# EAGLE design NFC_reva (EAGLE 7.2.0)
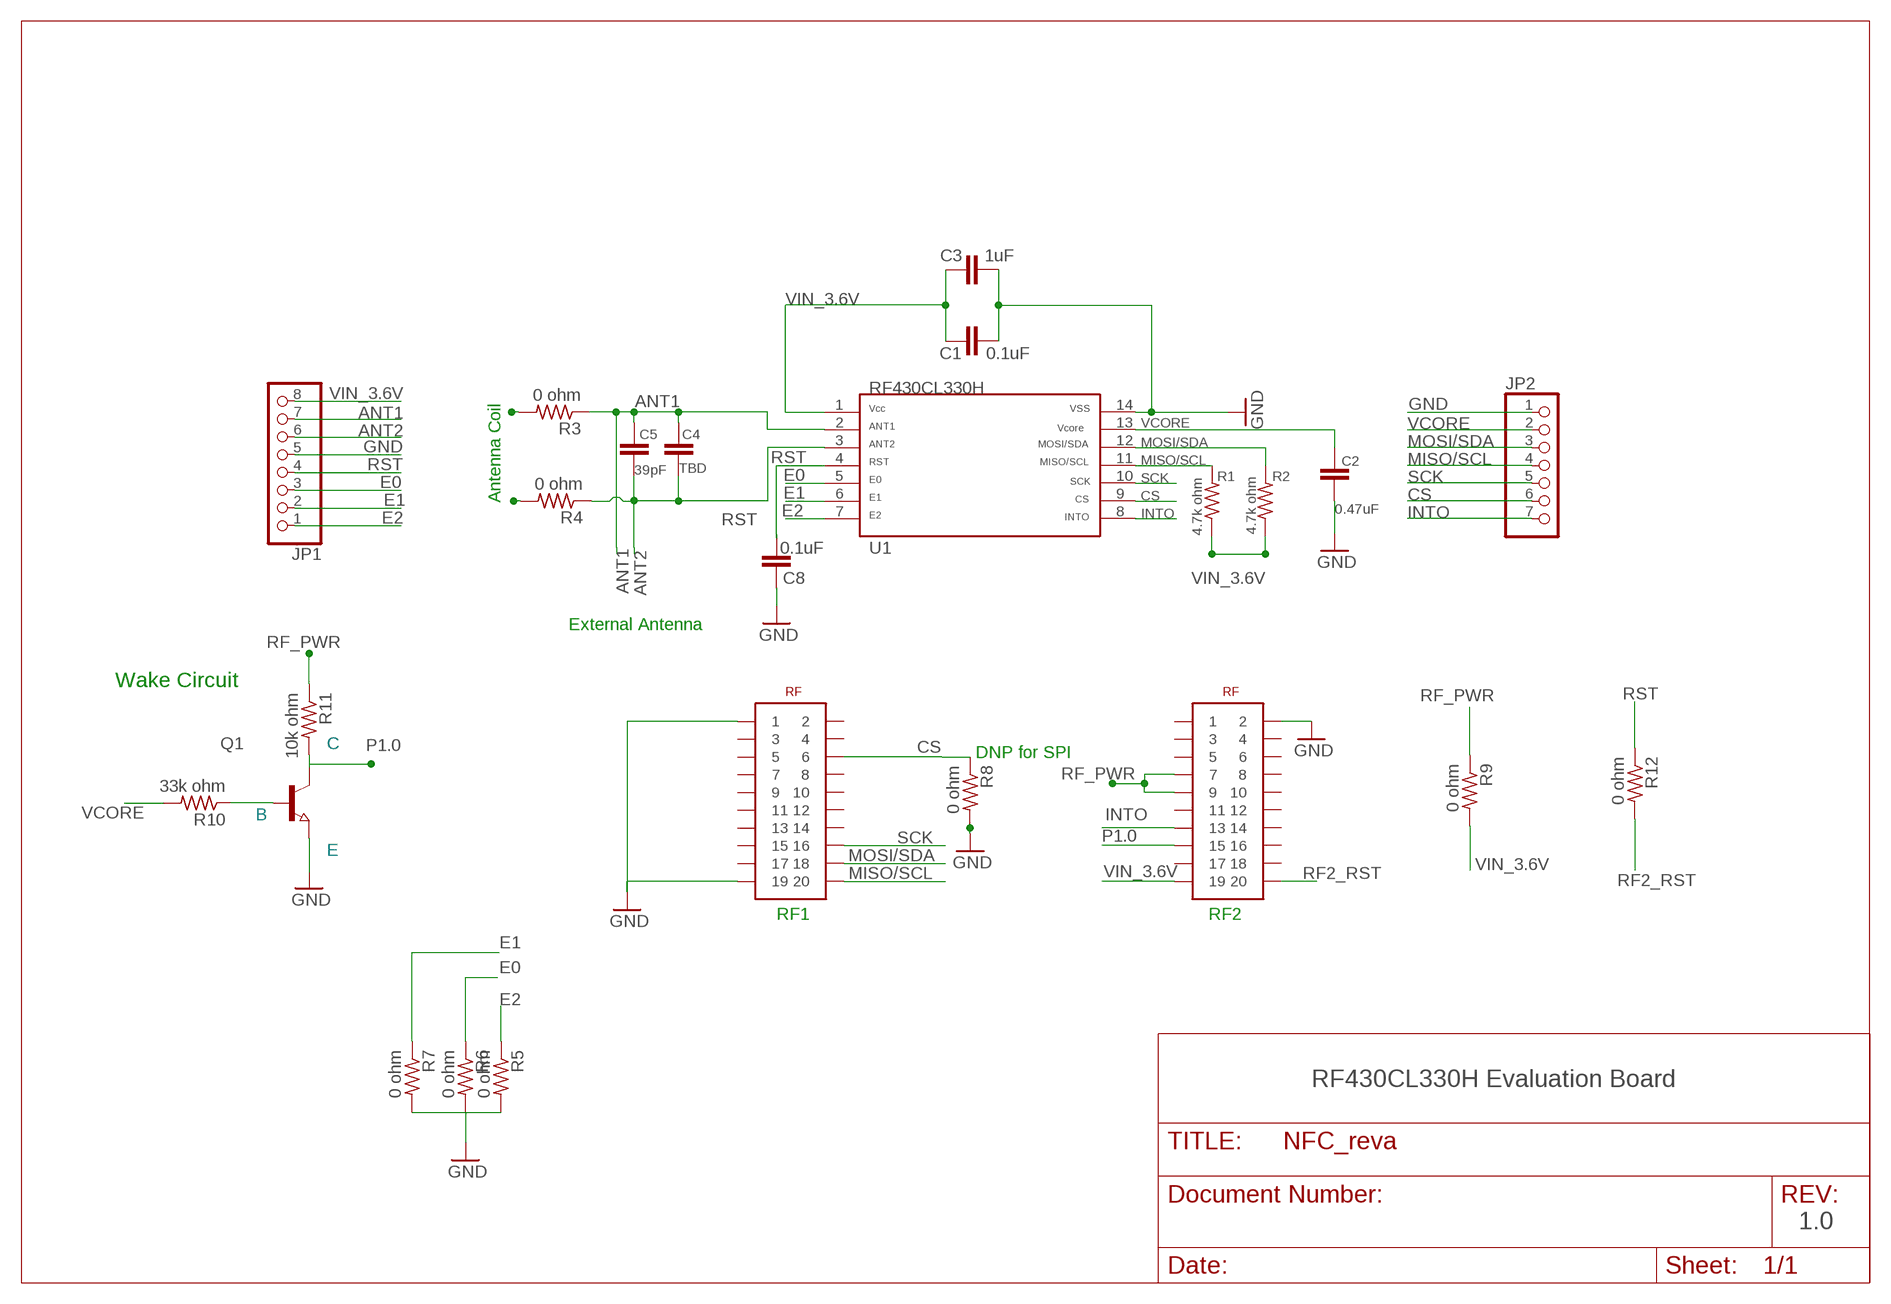
[diagram p0: schematic, sheet 1]

## Parts
C1  0.1uF  C-EUC0603  [C0603]
C2  0.47uF  C-EUC0603  [C0603]
C3  1uF  C-EUC0603  [C0603]
C4  TBD  C-EUC0603  [C0603]
C5  39pF  C-EUC0603  [C0603]
C8  0.1uF  C-EUC0603  [C0603]
JP1  PINHD-1X8  [1X08]
JP2  PINHD-1X7  [1X07]
Q1  NPN-TRANSISTOR_SOT23  [SOT23]
R1  4.7k ohm  R-US_R0402  [R0402]
R2  4.7k ohm  R-US_R0402  [R0402]
R3  0 ohm  R-US_R0402  [R0402]
R4  0 ohm  R-US_R0402  [R0402]
R5  0 ohm  R-US_R0402  [R0402]
R6  0 ohm  R-US_R0402  [R0402]
R7  0 ohm  R-US_R0402  [R0402]
R8  0 ohm  R-US_R0402  [R0402]
R9  0 ohm  R-US_R0402  [R0402]
R10  33k ohm  R-US_R0402  [R0402]
R11  10k ohm  R-US_R0402  [R0402]
R12  0 ohm  R-US_R0402  [R0402]
RF_HEADER  EM_HEADER  [TFM-110-02-SM-D-A-K]
U1  RF430CL330H  [PW14]

## Nets
ANT1: C4.1 C5.1 JP1.7 R3.1 U1.2
ANT2: C4.2 C5.2 JP1.6 R4.1 U1.3
CS: JP2.6 R8.1 RF_HEADER.6 U1.9
E0: JP1.3 R6.1 U1.5
E1: JP1.2 R7.1 U1.6
E2: JP1.1 R5.1 U1.7
GND [Ground]: C1.2 C2.2 C3.2 C8.1 JP1.5 JP2.1 Q1.2(E) R5.2 R6.2 R7.2 R8.2 RF_HEADER.1 RF_HEADER.19 RF_HEADER.22 U1.14
INTO: JP2.7 RF_HEADER.33 U1.8
MISO/SCL: JP2.4 R1.2 RF_HEADER.20 U1.11
MOSI/SDA: JP2.3 R2.2 RF_HEADER.18 U1.12
N$1: Q1.1(B) R10.1
N$3: R4.2
N$9: R3.2
P1.0: Q1.3(C) R11.2 RF_HEADER.35
RF2_RST: R12.2 RF_HEADER.40
RF_PWR: R9.1 R11.1 RF_HEADER.27 RF_HEADER.29
RST: C8.2 JP1.4 R12.1 U1.4
SCK: JP2.5 RF_HEADER.16 U1.10
VCORE: C2.1 JP2.2 R10.2 U1.13
VIN_3.6V: C1.1 C3.1 JP1.8 R1.1 R2.1 R9.2 RF_HEADER.39 U1.1
Unconnected: RF_HEADER.2 RF_HEADER.3 RF_HEADER.4 RF_HEADER.5 RF_HEADER.7 RF_HEADER.8 RF_HEADER.9 RF_HEADER.10 RF_HEADER.11 RF_HEADER.12 RF_HEADER.13 RF_HEADER.14 RF_HEADER.15 RF_HEADER.17 RF_HEADER.21 RF_HEADER.23 RF_HEADER.24 RF_HEADER.25 RF_HEADER.26 RF_HEADER.28 RF_HEADER.30 RF_HEADER.31 RF_HEADER.32 RF_HEADER.34 RF_HEADER.36 RF_HEADER.37 RF_HEADER.38

## Notes on the sheet
- Antenna Coil
- External Antenna
- Wake Circuit
- DNP for SPI
- RF1 | RF2
- RF430CL330H Evaluation Board
- 1.0

## Library data of the parts
C1-C5 C8 = resistor:C-EU: CAPACITOR, European symbol
JP1 = pinhead:PINHD-1X8: PIN HEADER
JP2 = pinhead:PINHD-1X7: PIN HEADER
Q1 = RFID_Automotive:NPN-TRANSISTOR_: NPN TRANSISTOR
R1-R12 = rcl:R-US_: RESISTOR, American symbol
RF_HEADER = _MSP430_RF:EM_HEADER
U1 = TI_MSP430_v16:RF430CL330H: RF430CL330H ISO14443B Dynamic NFC Tag

## Net classes
0 Default: width 0.254 mm, drill 0.305 mm, clearance 0.152 mm
1 Ground: width 0.305 mm, drill 0.305 mm, clearance 0.152 mm to class 0, clearance 0.152 mm
2 Power: width 0.406 mm, drill 0.305 mm, clearance 0.152 mm to class 0, clearance 0.152 mm to class 1, clearance 0.152 mm

## Board
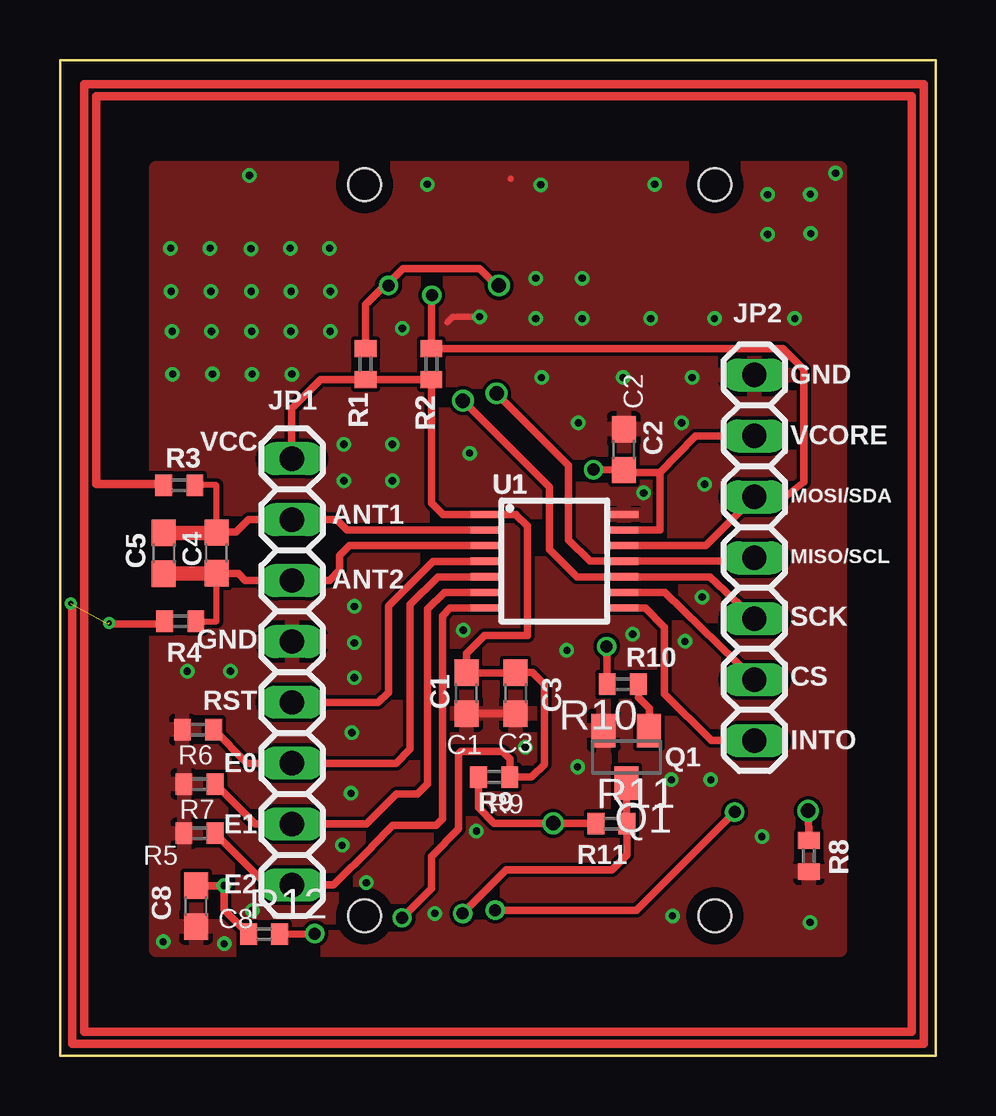
[diagram p1: board, top side]
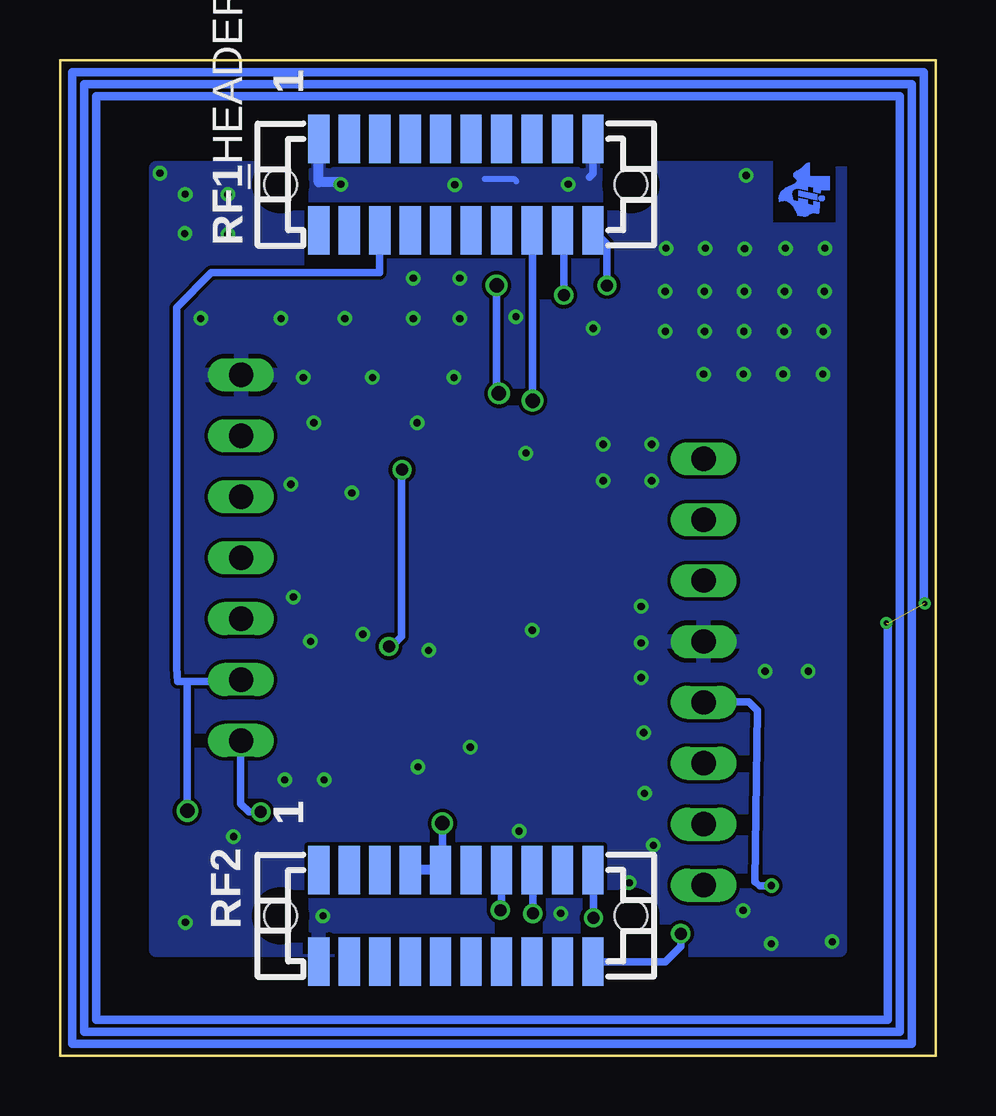
[diagram p2: board, bottom side, seen from below]

Size 36.5 x 41.5 mm. Coordinates in mm from the lower left corner, seen from the top.
Outline: 0,0 36.5,0 36.5,41.5 0,41.5 0,0
Copper layers (1+2*15+16): Top 0.0178mm / dielectric 12mil / GND 0.0356mm / dielectric 27mil / PWR 0.0356mm / dielectric 12mil / Bottom 0.0178mm
Design rules "5529 Design Rules": minimum track width 6mil, minimum drill 12mil, track to track 6mil, track to pad 6mil, pad to pad 6mil, via to via 6mil, smd to smd 6mil, copper to edge 20mil, drill to drill 8mil, minimum pad ring 7mil, minimum via ring 6mil, stop-mask expansion 0mil, vias tented up to drill 25mil, thermal gap 8mil

### Footprints (pad centres in the part's own frame; a part is rotated, then mirrored left to right if it is on the bottom)
C0603 = smd 1.1 x 1: 1 -0.85,0; 2 0.85,0
1X08 = drill 1.016 long: 1 -8.89,0; 2 -6.35,0; 3 -3.81,0; 4 -1.27,0; 5 1.27,0; 6 3.81,0; 7 6.35,0; 8 8.89,0
1X07 = drill 1.016 long: 1 -7.62,0; 2 -5.08,0; 3 -2.54,0; 4 0,0; 5 2.54,0; 6 5.08,0; 7 7.62,0
SOT23 = smd 1 x 1.4: 1 -0.95,-1.1; 2 0.95,-1.1; 3 0,1.1
R0402 = smd 0.7 x 0.9: 1 -0.65,0; 2 0.65,0
TFM-110-02-SM-D-A-K = smd 2.032 x 0.889 bottom: 1 -1.905,5.715; 2 1.905,5.715; 3 -1.905,4.445; 4 1.905,4.445; 5 -1.905,3.175; 6 1.905,3.175; 7 -1.905,1.905; 8 1.905,1.905; 9 -1.905,0.635; 10 1.905,0.635; 11 -1.905,-0.635; 12 1.905,-0.635; 13 -1.905,-1.905; 14 1.905,-1.905; 15 -1.905,-3.175; 16 1.905,-3.175; 17 -1.905,-4.445; 18 1.905,-4.445; 19 -1.905,-5.715; 20 1.905,-5.715; 21 28.575,5.715; 22 32.385,5.715; 23 28.575,4.445; 24 32.385,4.445; 25 28.575,3.175; 26 32.385,3.175; 27 28.575,1.905; 28 32.385,1.905; 29 28.575,0.635; 30 32.385,0.635; 31 28.575,-0.635; 32 32.385,-0.635; 33 28.575,-1.905; 34 32.385,-1.905; 35 28.575,-3.175; 36 32.385,-3.175; 37 28.575,-4.445; 38 32.385,-4.445; 39 28.575,-5.715; 40 32.385,-5.715 | hole 1.359: 0,7.303; 0,-7.303; 30.48,7.303; 30.48,-7.303
PW14 = smd 0.3 x 1.2: 1 -1.95,-2.9; 2 -1.3,-2.9; 3 -0.65,-2.9; 4 0,-2.9; 5 0.65,-2.9; 6 1.3,-2.9; 7 1.95,-2.9; 8 1.95,2.9; 9 1.3,2.9; 10 0.65,2.9; 11 0,2.9; 12 -0.65,2.9; 13 -1.3,2.9; 14 -1.95,2.9

### Placement (x,y rotation side)
C1  16.94,15.1 270 top
C2  23.5,25.26 90 top
C3  19,15.1 270 top
C4  6.52,20.95 270 top
C5  4.33,20.94 270 top
C8  5.67,6.23 90 top
JP1  9.67,15.99 90 top
JP2  28.95,20.75 270 top
Q1  23.61,12.45 180 top
R1  12.74,28.82 90 top
R2  15.49,28.82 90 top
R3  4.97,23.77 180 top
R4  5.02,18.1 180 top
R5  5.82,9.27 180 top
R6  5.75,13.59 180 top
R7  5.82,11.32 180 top
R8  31.22,8.32 270 top
R9  18.1,11.61 0 top
R10  23.46,15.48 180 top
R11  22.99,9.67 0 top
R12  8.51,5.06 0 top
RF_HEADER  20,36.31 270 top
U1  20.61,20.61 270 top
U$4  [MSP430_LAB_TILOGO_SMALL]  5.21,36.01 270 bottom

### Tracks (layer width: path | path; a pad name or v marks a point on that pad's centre or on a via)
ANT1
  Top 0.254: R3.1 6.52,23.77 C4.1 6.54,21.82
  Top 0.305: U1.2 11.96,21.91 11.53,22.34 JP1.7 7.87,22.34 7.35,21.82 6.54,21.82
  Top 0.61: C5.1 C4.1
ANT2
  Top 0.254: R4.1 6.52,18.1 6.52,20.09 | JP1.6 | C4.2 6.53,20.09
  Top 0.305: U1.3 12.08,21.26 11.66,20.84 11.66,20.23 11.24,19.81 JP1.6 7.72,19.81 7.44,20.09 6.53,20.09
  Top 0.61: C5.2 6.52,20.09 C4.2
CS  (via drill 0.6)
  Top 0.305: U1.9 25.21,19.31 JP2.6 | R8.1 v31.19,10.2
  Bottom 0.305: RF_HEADER.6 23.17,33.63 23.17,32.63 30.19,32.63 31.63,31.17 31.63,16.16 31.59,15.6 31.09,15.6 | 31.09,15.6 28.92,15.6 JP2.6 | v31.19,10.2 31.19,15.5 31.09,15.6
E0
  Top 0.254: JP1.3
  Top 0.305: U1.5 15.75,19.95 14.6,18.8 14.6,12.78 14,12.18 JP1.3 7.81,12.18 R6.1
E1
  Top 0.305: U1.6 16.03,19.31 15.33,18.61 15.33,11.32 14.91,10.9 14.03,10.9 12.78,9.65 JP1.2 | JP1.2 | JP1.2 8.13,9.65 R7.1
E2
  Top 0.305: U1.7 16.27,18.66 15.94,18.33 15.94,9.86 15.67,9.59 14.21,9.59 | 14.21,9.59 14.2,9.6 | 14.21,9.59 13.87,9.59 12.98,8.7 12.98,8.68 11.41,7.11 JP1.1 8.64,7.1 R5.1
GND  (via drill 0.3)
  Top 0.254: 18.78,36.56 18.79,36.55 | 17.47,30.81 16.39,30.81 16.15,30.57
  Top 0.305: C1.2 C3.2
  Bottom 0.254: 17.47,36.44 17.58,36.55 18.79,36.55
  Bottom 0.305: 14.28,37.88 RF_HEADER.19 | 14.28,37.88 14.06,37.66 | 14.28,37.88 14.28,36.76 14.43,36.61
  Bottom 0.406: RF_HEADER.1 25.71,36.4 24.79,36.4 v24.79,36.32
  other vias: 17.07,25.11 26.87,23.81 14.27,30.31 25.49,11.49 26.05,17.26 26.77,19.11 20.07,28.26 23.87,17.56 31.27,5.55 32.33,36.78 21.57,12.03 12.13,10.93 12.16,13.46 21.13,16.89 16.81,17.73 19.83,32.4 4.31,4.74 30.63,30.72 27.28,30.72 15.31,36.32 7.89,36.69 21.61,26.37 11.83,25.48 17.49,30.8 7.1,16.02 12.27,18.72 17.36,9.35 6.84,4.66 4.63,31.85 6.25,33.65 24.33,23.45 19.39,12.85 6.29,31.85 4.61,33.65 7.97,31.85 9.59,33.65 9.63,31.85 7.95,33.63 9.62,30.19 9.66,28.4 7.98,30.19 8,28.4 6.31,30.19 6.35,28.41 6.35,28.4 4.67,30.19 4.69,28.4 21.77,32.4 21.77,30.72 19.83,30.72 24.62,30.72 27.13,11.49 29.26,9.12 5.3,16.02 12.27,17.2 12.27,15.75 11.76,8.76 12.77,7.2 8.02,6.05 29.5,35.89 31.3,34.27 29.5,34.23 31.28,35.91 23.47,28.26 26.35,28.26 25.91,26.37 13.85,25.48 11.83,23.96 13.85,23.96 11.23,33.65 11.27,31.85 11.26,30.19 20.04,36.3 25.53,5.82 15.62,5.92
  pour Bottom: 4,37 32.5,37 32.5,4.4 4,4.4
  pour Top: 32.5,37 32.5,4.4 4,4.4 4,37
INTO  (via drill 0.5)
  Top 0.305: U1.8 24.4,18.65 25.2,17.85 25.2,15.08 27.15,13.13 JP2.7 | v18.14,6.06 24.04,6.06 25.15,7.17 v28.13,10.15
  Bottom 0.305: RF_HEADER.33 18.09,6.11 v18.14,6.06 | v28.13,10.15 28.62,10.15 28.97,10.5 28.97,13.11 JP2.7
MISO/SCL  (via drill 0.5, 0.6)
  Top 0.305: JP2.4 28.81,20.61 U1.11 22.09,20.61 21.2,21.5 21.2,24.6 v18.2,27.6 | v18.3,32.1 18.19,32.1 17.49,32.8 14.31,32.8 13.7,32.19 v13.7,32.1 13.53,32.1 12.74,31.31 R1.2
  Bottom 0.305: v13.7,32.1 13.7,33.82 RF_HEADER.20 | v18.2,27.6 18.3,27.6 v18.3,32.1
MOSI/SDA  (via drill 0.5)
  Top 0.305: U1.12 26.92,21.26 JP2.3 29.1,23.26 30.2,23.27 31,23.9 31,24.2 31,28.6 30.13,29.47 R2.2 15.49,31.69 v15.5,31.7
  Bottom 0.305: v15.5,31.7 15.5,34.35 RF_HEADER.18
N$1
  Top 0.305: R10.1 24.11,14.93 24.57,14.47 Q1.1
N$2
  Top 0.35: 1.5,39.97 1.5,23.83 4.26,23.83 4.26,23.85
N$7  (via drill 0.2)  (3 unrouted)
  Top 0.305: 2,18 4.2,18
  Bottom 0.25: 2.1,1.5 2,1.5 2.1,1.5
  Bottom 0.35: 2.1,1.5 35,1.5 35,40 1.5,40 1.5,1 35.5,1 35.5,40.5 1,40.5 | 2,1.5 2,18
  other vias: 0.45,18.84 2.05,18.03
N$21  (1 unrouted)
  Top 0.35: 0.5,18.8 0.5,0.5 36,0.5 36,40.5 1,40.5
  Bottom 0.35: 1,40.5 1,0.5 36,0.5 36,41 0.5,41 0.5,18.8
N$22
  Top 0.35: 1,40.5 1,1 35.5,1 35.5,40 1.5,40
P1.0  (via drill 0.5)
  Top 0.305: Q1.3 23.61,9.7 R11.2 23.64,8.36 23.01,7.73 18.6,7.73 v16.79,5.92
  Bottom 0.305: v16.79,5.92 16.79,7.7 RF_HEADER.35
RF2_RST  (via drill 0.5)
  Top 0.305: v10.62,5.08 R12.2
  Bottom 0.305: v10.62,5.08 10.62,4.56 11.27,3.91 RF_HEADER.40
RF_PWR  (via drill 0.6)
  Top 0.305: R9.1 17.44,10.34 18.1,9.68 v20.56,9.68 R11.1
  Bottom 0.254: RF_HEADER.29 20.55,7.73 20.55,7.95
  Bottom 0.305: v20.56,9.68 20.55,7.95
  Bottom 0.406: RF_HEADER.29 RF_HEADER.27
RST  (via drill 0.3)
  Top 0.305: U1.4 17.7,20.6 15.55,20.6 13.69,18.74 13.69,15.14 13.27,14.72 JP1.4 | C8.2 v6.84,7.08 6.84,6.08 R12.1
  Bottom 0.305: JP1.4 7.78,14.73 7.43,14.38 7.53,7.24 7.33,7.08 v6.84,7.08
SCK  (via drill 0.6)
  Top 0.305: JP2.5 27.1,19.96 U1.10 21.54,19.96 20.4,21.1 20.4,23.7 v16.8,27.3
  Bottom 0.305: v16.8,27.3 16.8,34.38 RF_HEADER.16
VCORE  (via drill 0.5)
  Top 0.254: C2.1 23.61,24.41
  Top 0.305: 26.48,25.83 JP2.2 | 25,24.3 26.48,25.83 | 25,24.3 25,21.9 24.89,21.91 U1.13 | 26.48,25.83 26.5,25.8 | 25,24.3 23.5,24.3 C2.1 | R10.2 22.81,17.03 v22.79,17.05 | C2.1 23.49,24.42 | C2.1 23.08,24.41 v22.24,24.42
  Bottom 0.305: v22.79,17.05 22.67,17.05 22.26,17.46 22.26,24.39 v22.24,24.42
VIN_3.6V  (via drill 0.5)
  Top 0.254: JP1.8
  Top 0.305: JP1.8 9.66,26.97 10.86,28.17 R1.1 R2.1 15.49,23.04 15.97,22.56 U1.1 19.02,22.56 19.02,22.54 19.49,22.07 19.49,17.51 17.69,17.51 16.94,16.76 C1.1 C3.1 19.69,15.96 20.19,15.46 20.19,12.14 19.66,11.61 R9.2 18.75,12.37 18.44,12.68 16.71,12.68 16.61,12.58 16.61,9.44 15.48,8.31 15.48,6.96 v14.26,5.74
  Bottom 0.305: v14.26,5.74 14.26,7.71 RF_HEADER.39

### Text on the board
GND: G
PWR: P
_tplace: JP2 | JP1 | R1 | R1 | R1 | R1 | R2 | R2 | R2 | R2 | GND | VCC | R3 | R3 | R3 | C2 | VCORE | U1 | U1 | U1 | U1 | MOSI/SDA | C4 | ANT1 | MISO/SCL | C5 | C5 | ANT2 | GND | SCK | R10 | R4 | C1 | C3 | RST | CS | E0 | Q1 | INTO | R9 | E1 | R11 | R8 | R8 | R8 | E2 | C8
_bplace: 1 | 1 | 1 | 1 | RF1 | 1 | 1 | 1 | 1 | RF2